# EAGLE design LM2941 Variable Regulator(5VDC-10VDC) (EAGLE 9.6.2)
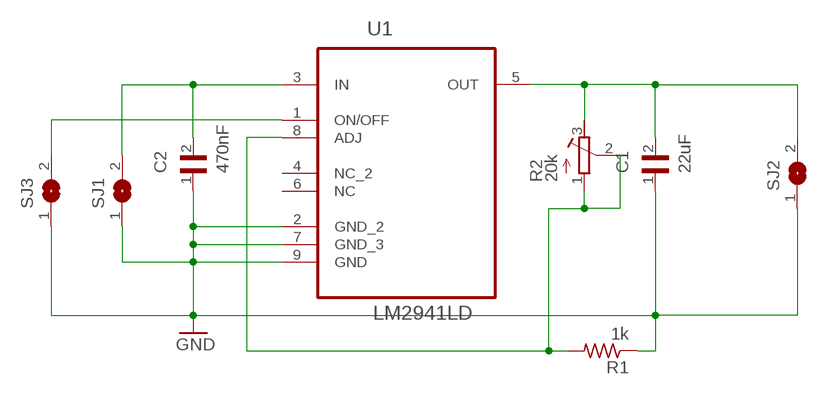
[diagram p0: schematic, sheet 1]

## Parts
C1  22uF  KCM55QR7YA226KH01L  [CAPC6153X390N]
C2  470nF  GRM188R7YA474KE05D  [CAPC1608X90N]
R1  1k  R-US_R0805  [R0805]
R2  20k  R-TRIMM3214W  [RTRIM3214W]
SJ1  SJW  [SJW]
SJ2  SJW  [SJW]
SJ3  SJW  [SJW]
U1  LM2941LD  [DFN400X400X80-9N]

## Nets
GND: C1.1 C2.1 R1.1 SJ1.1 SJ2.1 SJ3.1 U1.2(GND_2) U1.7(GND_3) U1.9(GND)
N$1: C2.2 SJ1.2 U1.3(IN)
N$4: R1.2 R2.1(A) R2.2(S) U1.8(ADJ)
N$6: C1.2 R2.3(E) SJ2.2 U1.5(OUT)
N$8: SJ3.2 U1.1(ON/OFF)
Unconnected: U1.4(NC_2) U1.6(NC)

## Library data of the parts
C1 = Capacitor_22uF_smd:KCM55QR7YA226KH01L; AVAILABILITY: Unavailable; DESCRIPTION: SMD Capacitor X7R(EIA) with Capacitance: 22uF Tol. 10%. Rated Voltage: 35Vdc; MF: Murata; MP: KCM55QR7YA226KH01L; PACKAGE: 6153 Murata; PRICE: None
C2 = Capacitor_0.47uF_smd:GRM188R7YA474KE05D: SMD Capacitor X7R(EIA) with Capacitance: 0.47uF Tol. 10%. Rated Voltage: 35Vdc Check prices <https://pricing.snapeda.com/search/part/GRM188R7YA474KE05D/?ref=eda>; AVAILABILITY: Warning; DESCRIPTION: SMD capacitor X7R(EIA) with capacitance 0.47uF Tol.10%. Rated voltage 35Vdc 125C; MF: Murata; MP: GRM188R7YA474KE05D; PACKAGE: 1608 Murata; PRICE: None; PURCHASE-URL: https://pricing.snapeda.com/search/part/GRM188R7YA474KE05D/?ref=eda
R1 = rcl:R-US_: RESISTOR, American symbol; SPICEPREFIX: R
R2 = rcl:R-TRIMM: Trimm resistor; SPICEMODEL: X; SPICEPREFIXL: POT
SJ1-SJ3 = jumper:SJ: SMD solder JUMPER
U1 = LM2941LD:LM2941LD: REG LDO Check prices <https://pricing.snapeda.com/search/part/LM2941LD/?ref=eda>; AVAILABILITY: Warning; DESCRIPTION: 1-A, 26-V, high-PSRR, adjustable low-dropout voltage regulator with enable from -40C to +125C 8-WSON -40 to 125; MF: Texas Instruments; MP: LM2941LD; PACKAGE: WSON-8 Texas Instruments; PRICE: None; PURCHASE-URL: https://pricing.snapeda.com/search/part/LM2941LD/?ref=eda

## Board
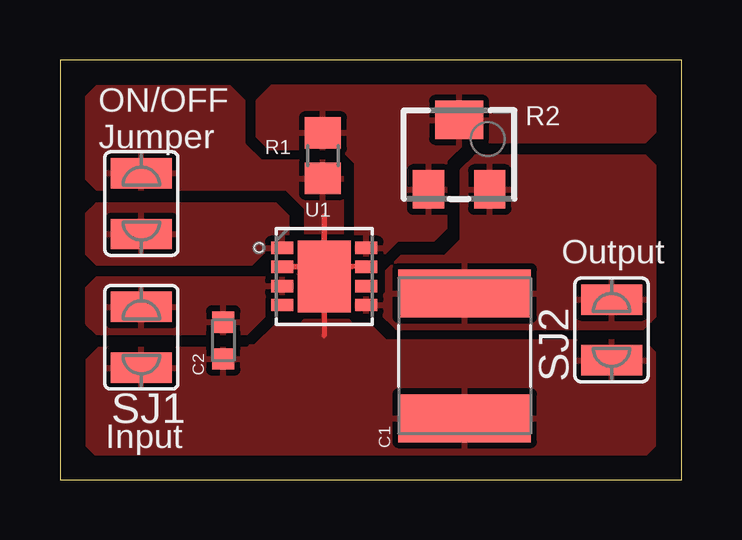
[diagram p1: board, top side]

Size 25.9 x 17.5 mm. Coordinates in mm from the lower left corner, seen from the top.
Outline: 0,0 25.9,0 25.9,17.5 0,17.5 0,0
Copper layers (1*16): Top 0.035mm / dielectric 1.5mm / Bottom 0.035mm
Design rules "default": minimum track width 6mil, minimum drill 0.35mm, track to track 6mil, track to pad 6mil, pad to pad 6mil, via to via 6mil, smd to smd 6mil, copper to edge 40mil, drill to drill 6mil, minimum pad ring 10mil, minimum via ring 8mil, stop-mask expansion 4mil, vias tented up to drill 0mil, thermal gap 10mil

### Footprints (pad centres in the part's own frame; a part is rotated, then mirrored left to right if it is on the bottom)
CAPC6153X390N = smd 2 x 5.52: 1 -2.603,0; 2 2.603,0
CAPC1608X90N = smd 0.89 x 0.93: 1 -0.77,0; 2 0.77,0
R0805 = smd 1.3 x 1.5: 1 -0.95,0; 2 0.95,0
RTRIM3214W = smd 1.3 x 1.6: 1 -1.275,-1.45; 3 1.275,-1.45 | smd 2 x 1.6: 2 0,1.45
SJW = smd 1.27 x 2.54: 1 -1.27,0; 2 1.27,0
DFN400X400X80-9N = smd 0.914 x 0.508: 1 -1.753,1.194; 2 -1.753,0.406; 3 -1.753,-0.406; 4 -1.753,-1.194; 5 1.753,-1.194; 6 1.753,-0.406; 7 1.753,0.406; 8 1.753,1.194 | smd 2.21 x 2.997: 9 0,0

### Placement (x,y rotation side)
C1  16.86,5.16 90 top
C2  6.8,5.8 90 top
R1  10.95,13.51 90 top
R2  16.63,13.55 0 top
SJ1  3.39,5.93 90 top
SJ2  22.98,6.24 90 top
SJ3  3.39,11.51 270 top
U1  11.01,8.47 0 top

### Tracks (layer width: path | path; a pad name or v marks a point on that pad's centre or on a via)
GND
  Top 0.203: U1.2 10.6,8.88 U1.9 | U1.7 11.42,8.88 U1.9 | U1.9 11,11 11.01,10.99 U1.9 | U1.9 11.01,6.01 11,6
  pour Top: 1.6,5.5 1.1,5 1.1,1.4 1.6,0.9 24.3,0.9 24.8,1.4 24.8,5.3 24.3,5.8 13.6,5.8 12.9,6.5 12.2,6.5 12,6.7 12,8.62 12.38,9 12.25,9 11.8,9.45 11.8,13.1 11.6,13.3 8.4,13.3 7.7,14 7.7,15.8 7.1,16.4 1.5,16.4 1,15.9 1,12.6 1.5,12.1 9.4,12.1 10.2,11.3 10.2,9.2 10.1,9.1 9,9.1 8.9,9 8.9,8.75 8.99,8.66 9.81,8.66 10.2,8.27 10.2,6.7 10,6.5 9,6.5 8.1,5.6 7.9,5.6 7.8,5.5
N$1
  pour Top: 1.1,6.5 1.5,6.1 7.8,6.1 8.5,6.8 8.5,7.6 8.6,7.7 9.6,7.7 9.7,7.8 9.7,8.3 9.6,8.4 1.5,8.4 1.1,8
N$4
  pour Top: 12.4,9.3 13.4,9.3 14.1,10 15.6,10 16.1,10.5 16.1,13.3 16.9,14.1 24.4,14.1 24.8,14.5 24.8,16 24.4,16.4 8.8,16.4 8.2,15.8 8.2,14.3 8.7,13.8 11.7,13.8 12.3,13.2 12.3,9.4
N$6
  pour Top: 12.4,7.6 12.3,7.5 12.3,7.1 12.4,7 13.3,7 14,6.3 24.3,6.3 24.8,6.8 24.8,13.1 24.4,13.5 17.3,13.5 16.7,12.9 16.7,10 16,9.3 14.2,9.3 13.6,8.7 13.6,7.8 13.4,7.6
N$8
  pour Top: 1.5,11.5 1.1,11.1 1.1,9.4 1.5,9 8,9 8.5,9.5 9,9.5 9.5,10 9.5,11 9,11.5

### Text on the board
tNames: ON/OFF / Jumper | Output | Input